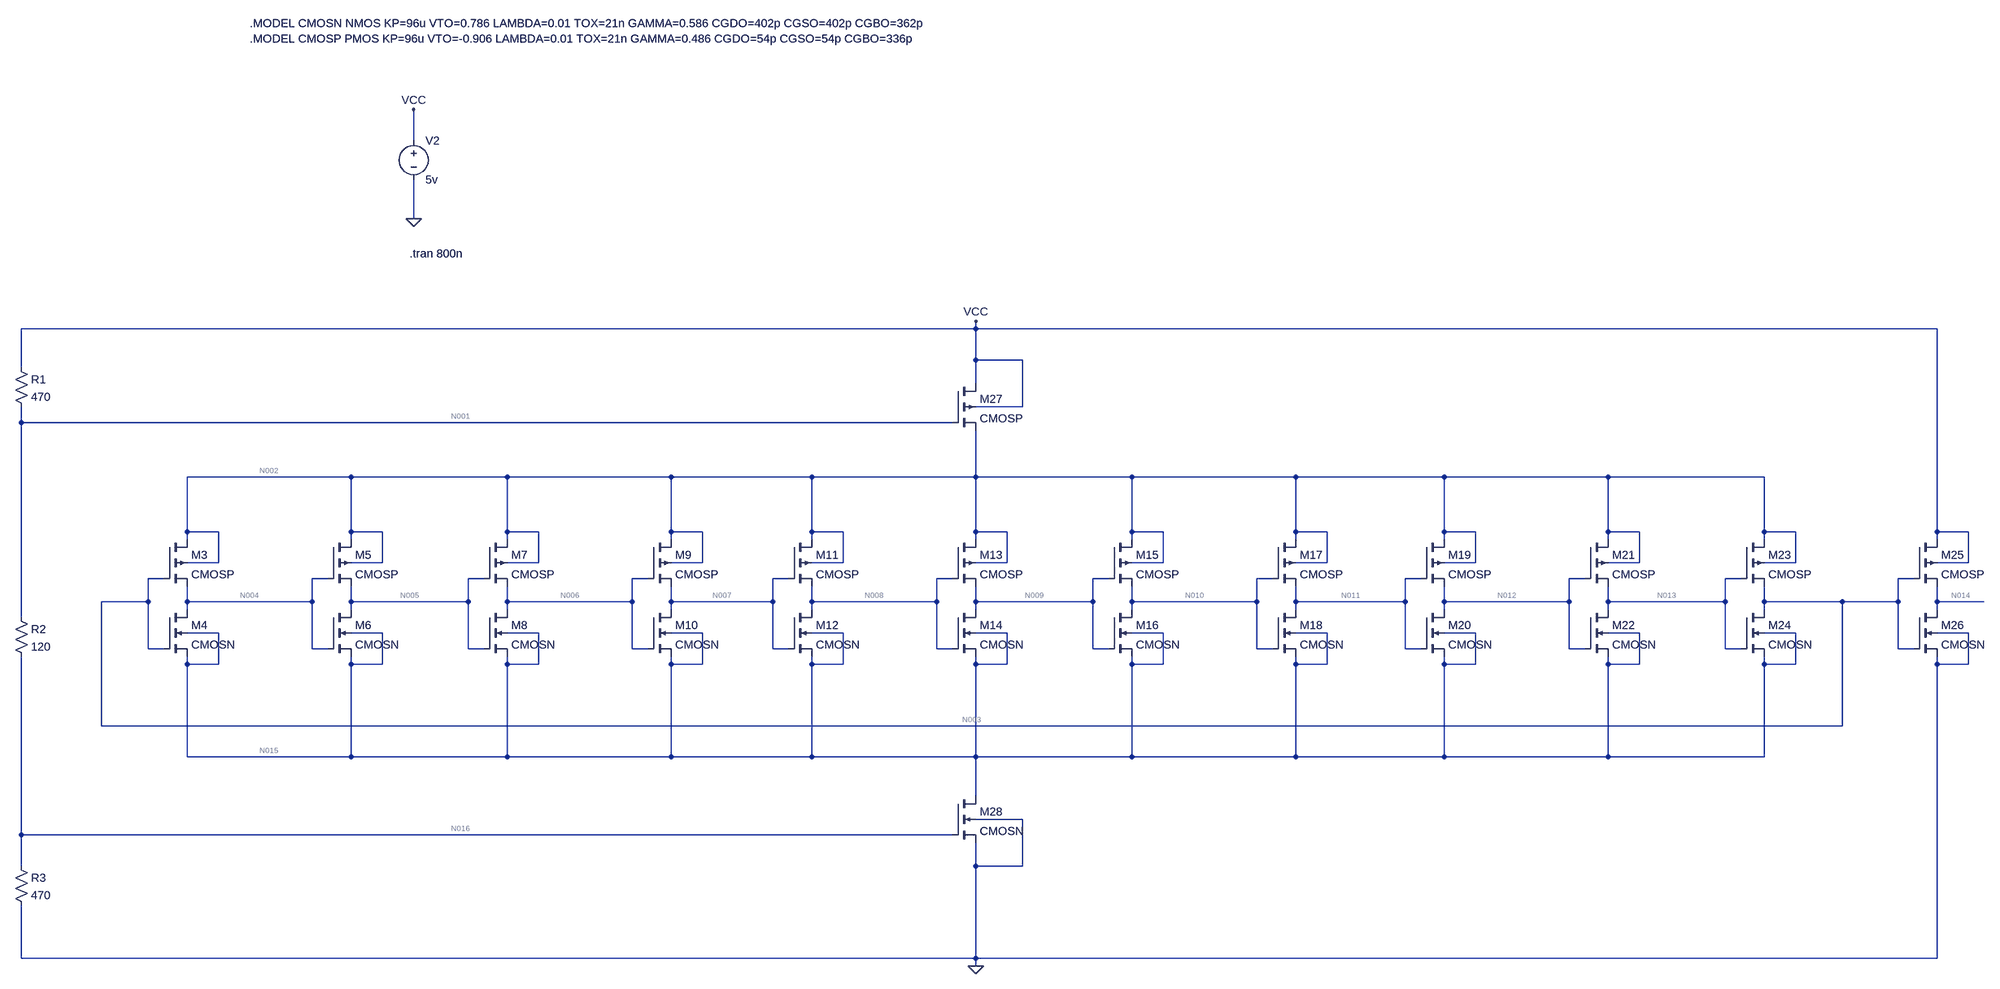
[diagram p0: schematic VCO.asc]
VCO.asc, the LTspice schematic file:
Version 4
SHEET 1 2052 1540
WIRE -1696 -400 -1696 -464
WIRE -1696 -240 -1696 -320
WIRE -544 128 -544 112
WIRE -544 128 -2608 128
WIRE 1536 128 -544 128
WIRE -544 192 -544 128
WIRE -448 192 -544 192
WIRE -2608 208 -2608 128
WIRE -544 240 -544 192
WIRE -448 288 -448 192
WIRE -448 288 -544 288
WIRE -2608 320 -2608 288
WIRE -592 320 -2608 320
WIRE -1824 432 -2160 432
WIRE -1504 432 -1824 432
WIRE -1168 432 -1504 432
WIRE -880 432 -1168 432
WIRE -544 432 -544 336
WIRE -544 432 -880 432
WIRE -224 432 -544 432
WIRE 112 432 -224 432
WIRE 416 432 112 432
WIRE 752 432 416 432
WIRE 1072 432 752 432
WIRE -2160 544 -2160 432
WIRE -2096 544 -2160 544
WIRE -1824 544 -1824 432
WIRE -1760 544 -1824 544
WIRE -1504 544 -1504 432
WIRE -1440 544 -1504 544
WIRE -1168 544 -1168 432
WIRE -1104 544 -1168 544
WIRE -880 544 -880 432
WIRE -816 544 -880 544
WIRE -544 544 -544 432
WIRE -480 544 -544 544
WIRE -224 544 -224 432
WIRE -160 544 -224 544
WIRE 112 544 112 432
WIRE 176 544 112 544
WIRE 416 544 416 432
WIRE 480 544 416 544
WIRE 752 544 752 432
WIRE 816 544 752 544
WIRE 1072 544 1072 432
WIRE 1136 544 1072 544
WIRE 1536 544 1536 128
WIRE 1600 544 1536 544
WIRE -2160 560 -2160 544
WIRE -1824 560 -1824 544
WIRE -1504 560 -1504 544
WIRE -1168 560 -1168 544
WIRE -880 560 -880 544
WIRE -544 560 -544 544
WIRE -224 560 -224 544
WIRE 112 560 112 544
WIRE 416 560 416 544
WIRE 752 560 752 544
WIRE 1072 560 1072 544
WIRE 1536 560 1536 544
WIRE -2096 608 -2096 544
WIRE -2096 608 -2160 608
WIRE -1760 608 -1760 544
WIRE -1760 608 -1824 608
WIRE -1440 608 -1440 544
WIRE -1440 608 -1504 608
WIRE -1104 608 -1104 544
WIRE -1104 608 -1168 608
WIRE -816 608 -816 544
WIRE -816 608 -880 608
WIRE -480 608 -480 544
WIRE -480 608 -544 608
WIRE -160 608 -160 544
WIRE -160 608 -224 608
WIRE 176 608 176 544
WIRE 176 608 112 608
WIRE 480 608 480 544
WIRE 480 608 416 608
WIRE 816 608 816 544
WIRE 816 608 752 608
WIRE 1136 608 1136 544
WIRE 1136 608 1072 608
WIRE 1600 608 1600 544
WIRE 1600 608 1536 608
WIRE -2208 640 -2240 640
WIRE -1872 640 -1904 640
WIRE -1552 640 -1584 640
WIRE -1216 640 -1248 640
WIRE -928 640 -960 640
WIRE -592 640 -624 640
WIRE -272 640 -304 640
WIRE 64 640 32 640
WIRE 368 640 336 640
WIRE 704 640 672 640
WIRE 1024 640 992 640
WIRE 1488 640 1456 640
WIRE -2240 688 -2240 640
WIRE -2240 688 -2336 688
WIRE -2160 688 -2160 656
WIRE -1904 688 -1904 640
WIRE -1904 688 -2160 688
WIRE -1824 688 -1824 656
WIRE -1584 688 -1584 640
WIRE -1584 688 -1824 688
WIRE -1504 688 -1504 656
WIRE -1248 688 -1248 640
WIRE -1248 688 -1504 688
WIRE -1168 688 -1168 656
WIRE -960 688 -960 640
WIRE -960 688 -1168 688
WIRE -880 688 -880 656
WIRE -624 688 -624 640
WIRE -624 688 -880 688
WIRE -544 688 -544 656
WIRE -304 688 -304 640
WIRE -304 688 -544 688
WIRE -224 688 -224 656
WIRE 32 688 32 640
WIRE 32 688 -224 688
WIRE 112 688 112 656
WIRE 336 688 336 640
WIRE 336 688 112 688
WIRE 416 688 416 656
WIRE 672 688 672 640
WIRE 672 688 416 688
WIRE 752 688 752 656
WIRE 992 688 992 640
WIRE 992 688 752 688
WIRE 1072 688 1072 656
WIRE 1232 688 1072 688
WIRE 1456 688 1456 640
WIRE 1456 688 1232 688
WIRE 1536 688 1536 656
WIRE 1632 688 1536 688
WIRE -2160 704 -2160 688
WIRE -1824 704 -1824 688
WIRE -1504 704 -1504 688
WIRE -1168 704 -1168 688
WIRE -880 704 -880 688
WIRE -544 704 -544 688
WIRE -224 704 -224 688
WIRE 112 704 112 688
WIRE 416 704 416 688
WIRE 752 704 752 688
WIRE 1072 704 1072 688
WIRE 1536 704 1536 688
WIRE -2608 720 -2608 320
WIRE -2096 752 -2160 752
WIRE -1760 752 -1824 752
WIRE -1440 752 -1504 752
WIRE -1104 752 -1168 752
WIRE -816 752 -880 752
WIRE -480 752 -544 752
WIRE -160 752 -224 752
WIRE 176 752 112 752
WIRE 480 752 416 752
WIRE 816 752 752 752
WIRE 1136 752 1072 752
WIRE 1600 752 1536 752
WIRE -2240 784 -2240 688
WIRE -2208 784 -2240 784
WIRE -1904 784 -1904 688
WIRE -1872 784 -1904 784
WIRE -1584 784 -1584 688
WIRE -1552 784 -1584 784
WIRE -1248 784 -1248 688
WIRE -1216 784 -1248 784
WIRE -960 784 -960 688
WIRE -928 784 -960 784
WIRE -624 784 -624 688
WIRE -592 784 -624 784
WIRE -304 784 -304 688
WIRE -272 784 -304 784
WIRE 32 784 32 688
WIRE 64 784 32 784
WIRE 336 784 336 688
WIRE 368 784 336 784
WIRE 672 784 672 688
WIRE 704 784 672 784
WIRE 992 784 992 688
WIRE 1024 784 992 784
WIRE 1456 784 1456 688
WIRE 1488 784 1456 784
WIRE -2160 816 -2160 800
WIRE -2096 816 -2096 752
WIRE -2096 816 -2160 816
WIRE -1824 816 -1824 800
WIRE -1760 816 -1760 752
WIRE -1760 816 -1824 816
WIRE -1504 816 -1504 800
WIRE -1440 816 -1440 752
WIRE -1440 816 -1504 816
WIRE -1168 816 -1168 800
WIRE -1104 816 -1104 752
WIRE -1104 816 -1168 816
WIRE -880 816 -880 800
WIRE -816 816 -816 752
WIRE -816 816 -880 816
WIRE -544 816 -544 800
WIRE -480 816 -480 752
WIRE -480 816 -544 816
WIRE -224 816 -224 800
WIRE -160 816 -160 752
WIRE -160 816 -224 816
WIRE 112 816 112 800
WIRE 176 816 176 752
WIRE 176 816 112 816
WIRE 416 816 416 800
WIRE 480 816 480 752
WIRE 480 816 416 816
WIRE 752 816 752 800
WIRE 816 816 816 752
WIRE 816 816 752 816
WIRE 1072 816 1072 800
WIRE 1136 816 1136 752
WIRE 1136 816 1072 816
WIRE 1536 816 1536 800
WIRE 1600 816 1600 752
WIRE 1600 816 1536 816
WIRE -2336 1024 -2336 688
WIRE 1232 1024 1232 688
WIRE 1232 1024 -2336 1024
WIRE -2160 1088 -2160 816
WIRE -1824 1088 -1824 816
WIRE -1824 1088 -2160 1088
WIRE -1504 1088 -1504 816
WIRE -1504 1088 -1824 1088
WIRE -1168 1088 -1168 816
WIRE -1168 1088 -1504 1088
WIRE -880 1088 -880 816
WIRE -880 1088 -1168 1088
WIRE -544 1088 -544 816
WIRE -544 1088 -880 1088
WIRE -224 1088 -224 816
WIRE -224 1088 -544 1088
WIRE 112 1088 112 816
WIRE 112 1088 -224 1088
WIRE 416 1088 416 816
WIRE 416 1088 112 1088
WIRE 752 1088 752 816
WIRE 752 1088 416 1088
WIRE 1072 1088 1072 816
WIRE 1072 1088 752 1088
WIRE -544 1168 -544 1088
WIRE -448 1216 -544 1216
WIRE -2608 1248 -2608 800
WIRE -592 1248 -2608 1248
WIRE -2608 1312 -2608 1248
WIRE -544 1312 -544 1264
WIRE -448 1312 -448 1216
WIRE -448 1312 -544 1312
WIRE -2608 1504 -2608 1392
WIRE -544 1504 -544 1312
WIRE -544 1504 -2608 1504
WIRE 1536 1504 1536 816
WIRE 1536 1504 -544 1504
WIRE -544 1520 -544 1504
FLAG -1696 -240 0
FLAG -1696 -464 VCC
FLAG -544 112 VCC
FLAG -544 1520 0
SYMBOL voltage -1696 -416 R0
WINDOW 123 0 0 Left 0
WINDOW 39 0 0 Left 0
SYMATTR InstName V2
SYMATTR Value 5v
SYMBOL pmos4 -2208 560 R0
SYMATTR InstName M3
SYMATTR Value CMOSP
SYMATTR Value2 l=10u w=200u
SYMBOL nmos4 -2208 704 R0
SYMATTR InstName M4
SYMATTR Value CMOSN
SYMATTR Value2 l=10u w=100u
SYMBOL pmos4 -1872 560 R0
SYMATTR InstName M5
SYMATTR Value CMOSP
SYMATTR Value2 l=10u w=200u
SYMBOL nmos4 -1872 704 R0
SYMATTR InstName M6
SYMATTR Value CMOSN
SYMATTR Value2 l=10u w=100u
SYMBOL pmos4 -1552 560 R0
SYMATTR InstName M7
SYMATTR Value CMOSP
SYMATTR Value2 l=10u w=200u
SYMBOL nmos4 -1552 704 R0
SYMATTR InstName M8
SYMATTR Value CMOSN
SYMATTR Value2 l=10u w=100u
SYMBOL pmos4 -1216 560 R0
SYMATTR InstName M9
SYMATTR Value CMOSP
SYMATTR Value2 l=10u w=200u
SYMBOL nmos4 -1216 704 R0
SYMATTR InstName M10
SYMATTR Value CMOSN
SYMATTR Value2 l=10u w=100u
SYMBOL pmos4 -928 560 R0
SYMATTR InstName M11
SYMATTR Value CMOSP
SYMATTR Value2 l=10u w=200u
SYMBOL nmos4 -928 704 R0
SYMATTR InstName M12
SYMATTR Value CMOSN
SYMATTR Value2 l=10u w=100u
SYMBOL pmos4 -592 560 R0
SYMATTR InstName M13
SYMATTR Value CMOSP
SYMATTR Value2 l=10u w=200u
SYMBOL nmos4 -592 704 R0
SYMATTR InstName M14
SYMATTR Value CMOSN
SYMATTR Value2 l=10u w=100u
SYMBOL pmos4 -272 560 R0
SYMATTR InstName M15
SYMATTR Value CMOSP
SYMATTR Value2 l=10u w=200u
SYMBOL nmos4 -272 704 R0
SYMATTR InstName M16
SYMATTR Value CMOSN
SYMATTR Value2 l=10u w=100u
SYMBOL pmos4 64 560 R0
SYMATTR InstName M17
SYMATTR Value CMOSP
SYMATTR Value2 l=10u w=200u
SYMBOL nmos4 64 704 R0
SYMATTR InstName M18
SYMATTR Value CMOSN
SYMATTR Value2 l=10u w=100u
SYMBOL pmos4 368 560 R0
SYMATTR InstName M19
SYMATTR Value CMOSP
SYMATTR Value2 l=10u w=200u
SYMBOL nmos4 368 704 R0
SYMATTR InstName M20
SYMATTR Value CMOSN
SYMATTR Value2 l=10u w=100u
SYMBOL pmos4 704 560 R0
SYMATTR InstName M21
SYMATTR Value CMOSP
SYMATTR Value2 l=10u w=200u
SYMBOL nmos4 704 704 R0
SYMATTR InstName M22
SYMATTR Value CMOSN
SYMATTR Value2 l=10u w=100u
SYMBOL pmos4 1024 560 R0
SYMATTR InstName M23
SYMATTR Value CMOSP
SYMATTR Value2 l=10u w=200u
SYMBOL nmos4 1024 704 R0
SYMATTR InstName M24
SYMATTR Value CMOSN
SYMATTR Value2 l=10u w=100u
SYMBOL pmos4 1488 560 R0
SYMATTR InstName M25
SYMATTR Value CMOSP
SYMATTR Value2 l=10u w=200u
SYMBOL nmos4 1488 704 R0
SYMATTR InstName M26
SYMATTR Value CMOSN
SYMATTR Value2 l=10u w=100u
SYMBOL pmos4 -592 240 R0
SYMATTR InstName M27
SYMATTR Value CMOSP
SYMATTR Value2 l=10u w=200u
SYMBOL nmos4 -592 1168 R0
SYMATTR InstName M28
SYMATTR Value CMOSN
SYMATTR Value2 l=10u w=100u
SYMBOL res -2624 192 R0
SYMATTR InstName R1
SYMATTR Value 470
SYMBOL res -2624 704 R0
SYMATTR InstName R2
SYMATTR Value 120
SYMBOL res -2624 1296 R0
SYMATTR InstName R3
SYMATTR Value 470
TEXT -2032 -696 Left 2 !.MODEL CMOSN NMOS KP=96u VTO=0.786 LAMBDA=0.01 TOX=21n GAMMA=0.586 CGDO=402p CGSO=402p CGBO=362p
TEXT -2032 -664 Left 2 !.MODEL CMOSP PMOS KP=96u VTO=-0.906 LAMBDA=0.01 TOX=21n GAMMA=0.486 CGDO=54p CGSO=54p CGBO=336p
TEXT -1704 -168 Left 2 !.tran 800n

The netlist it stands for:
* VCO.asc
V2 VCC 0 5v
M3 N002 N003 N004 N002 CMOSP l=10u w=200u
M4 N004 N003 N015 N015 CMOSN l=10u w=100u
M5 N002 N004 N005 N002 CMOSP l=10u w=200u
M6 N005 N004 N015 N015 CMOSN l=10u w=100u
M7 N002 N005 N006 N002 CMOSP l=10u w=200u
M8 N006 N005 N015 N015 CMOSN l=10u w=100u
M9 N002 N006 N007 N002 CMOSP l=10u w=200u
M10 N007 N006 N015 N015 CMOSN l=10u w=100u
M11 N002 N007 N008 N002 CMOSP l=10u w=200u
M12 N008 N007 N015 N015 CMOSN l=10u w=100u
M13 N002 N008 N009 N002 CMOSP l=10u w=200u
M14 N009 N008 N015 N015 CMOSN l=10u w=100u
M15 N002 N009 N010 N002 CMOSP l=10u w=200u
M16 N010 N009 N015 N015 CMOSN l=10u w=100u
M17 N002 N010 N011 N002 CMOSP l=10u w=200u
M18 N011 N010 N015 N015 CMOSN l=10u w=100u
M19 N002 N011 N012 N002 CMOSP l=10u w=200u
M20 N012 N011 N015 N015 CMOSN l=10u w=100u
M21 N002 N012 N013 N002 CMOSP l=10u w=200u
M22 N013 N012 N015 N015 CMOSN l=10u w=100u
M23 N002 N013 N003 N002 CMOSP l=10u w=200u
M24 N003 N013 N015 N015 CMOSN l=10u w=100u
M25 VCC N003 N014 VCC CMOSP l=10u w=200u
M26 N014 N003 0 0 CMOSN l=10u w=100u
M27 VCC N001 N002 VCC CMOSP l=10u w=200u
M28 N015 N016 0 0 CMOSN l=10u w=100u
R1 VCC N001 470
R2 N001 N016 120
R3 N016 0 470
.model NMOS NMOS
.model PMOS PMOS
.lib standard.mos
.MODEL CMOSN NMOS KP=96u VTO=0.786 LAMBDA=0.01 TOX=21n GAMMA=0.586 CGDO=402p CGSO=402p CGBO=362p
.MODEL CMOSP PMOS KP=96u VTO=-0.906 LAMBDA=0.01 TOX=21n GAMMA=0.486 CGDO=54p CGSO=54p CGBO=336p
.tran 800n
.backanno
.end

* Results of the author's LTspice run, read from the files saved beside the schematic
* Operating Point, zero values left out:
*   V(vcc) = 5 V
*   V(n002) = 4.513 V
*   V(n003) = 3.3 V
*   V(n004) = 3.3 V
*   V(n015) = 2.081 V
*   V(n005) = 3.3 V
*   V(n006) = 3.3 V
*   V(n007) = 3.3 V
*   V(n008) = 3.3 V
*   V(n009) = 3.3 V
*   V(n010) = 3.3 V
*   V(n011) = 3.3 V
*   V(n012) = 3.3 V
*   V(n013) = 3.3 V
*   V(n014) = 276.8 mV
*   V(n001) = 2.783 V
*   V(n016) = 2.217 V
*   Id(M3) = 91.21 µA
*   Ib(M3) = 1.222 pA
*   Is(M3) = -91.21 µA
*   Id(M5) = 91.21 µA
*   Ib(M5) = 1.222 pA
*   Is(M5) = -91.21 µA
*   Id(M7) = 91.21 µA
*   Ib(M7) = 1.222 pA
*   Is(M7) = -91.21 µA
*   Id(M9) = 91.21 µA
*   Ib(M9) = 1.222 pA
*   Is(M9) = -91.21 µA
*   Id(M11) = 91.21 µA
*   Ib(M11) = 1.222 pA
*   Is(M11) = -91.21 µA
*   Id(M13) = 91.21 µA
*   Ib(M13) = 1.222 pA
*   Is(M13) = -91.21 µA
*   Id(M15) = 91.21 µA
*   Ib(M15) = 1.222 pA
*   Is(M15) = -91.21 µA
*   Id(M17) = 91.25 µA
*   Ib(M17) = 1.222 pA
*   Is(M17) = -91.25 µA
*   Id(M19) = 91.21 µA
*   Ib(M19) = 1.222 pA
*   Is(M19) = -91.21 µA
*   Id(M21) = 91.21 µA
*   Ib(M21) = 1.222 pA
*   Is(M21) = -91.21 µA
*   Id(M23) = 91.21 µA
*   Ib(M23) = 1.222 pA
*   Is(M23) = -91.21 µA
*   Id(M25) = 633.1 µA
*   Ib(M25) = 4.733 pA
*   Is(M25) = -633.1 µA
*   Id(M27) = 1.003 mA
*   Is(M27) = -1.003 mA
*   Id(M4) = 91.21 µA
*   Ib(M4) = -1.229 pA
*   Is(M4) = -91.21 µA
*   Id(M6) = 91.21 µA
*   Ib(M6) = -1.229 pA
*   Is(M6) = -91.21 µA
*   Id(M8) = 91.21 µA
*   Ib(M8) = -1.229 pA
*   Is(M8) = -91.21 µA
*   Id(M10) = 91.21 µA
*   Ib(M10) = -1.229 pA
*   Is(M10) = -91.21 µA
*   Id(M12) = 91.21 µA
*   Ib(M12) = -1.229 pA
*   Is(M12) = -91.21 µA
*   Id(M14) = 91.21 µA
*   Ib(M14) = -1.229 pA
*   Is(M14) = -91.21 µA
*   Id(M16) = 91.21 µA
*   Ib(M16) = -1.229 pA
*   Is(M16) = -91.21 µA
*   Id(M18) = 91.18 µA
*   Ib(M18) = -1.229 pA
*   Is(M18) = -91.18 µA
*   Id(M20) = 91.21 µA
*   Ib(M20) = -1.229 pA
*   Is(M20) = -91.21 µA
*   Id(M22) = 91.21 µA
*   Ib(M22) = -1.229 pA
*   Is(M22) = -91.21 µA
*   Id(M24) = 91.21 µA
*   Ib(M24) = -1.229 pA
*   Is(M24) = -91.21 µA
*   Id(M26) = 633.1 µA
*   Is(M26) = -633.1 µA
*   Id(M28) = 1.003 mA
*   Ib(M28) = -2.091 pA
*   Is(M28) = -1.003 mA
*   I(R1) = 4.717 mA
*   I(R2) = 4.717 mA
*   I(R3) = 4.717 mA
*   I(V2) = -6.353 mA
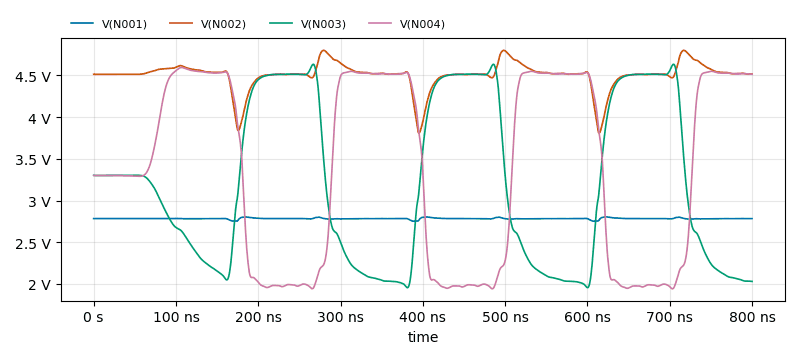
[diagram p1: Transient Analysis of VCO.asc, plotted from the saved traces]
* Transient Analysis, 1 run:
*   V(N001): min 2.752 V, max 2.804 V, average 2.783 V, rms 2.783 V, last 2.783 V
*   V(N002): min 3.808 V, max 4.8 V, average 4.505 V, rms 4.508 V, last 4.517 V
*   V(N003): min 1.955 V, max 4.633 V, average 3.21 V, rms 3.363 V, last 2.03 V
*   V(N004): min 1.942 V, max 4.595 V, average 3.377 V, rms 3.559 V, last 4.515 V